# Altium schematic sheet Reset.SchDoc
size A4
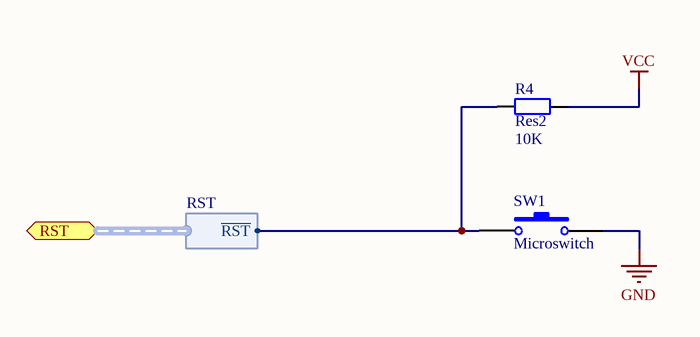
[diagram p0: Reset.SchDoc]

## Parts
R4  Res2  value 10K  [AXIAL-0.4]
SW1  Microswitch  [DIP Microswitch 6x6mm]

## Ports
RST (harness RST)

## Harnesses
RST: ~{RST}

## Nets
GND: SW1.2
VCC: R4.2
NetR4_1: R4.1 SW1.1 ; port RST.~{RST}

## Library data of the parts
R4 = Res2: Resistor; Published: 8-Jun-2000; LatestRevisionDate: 17-Jul-2002; LatestRevisionNote: Re-released for DXP Platform.; PackageReference: AXIAL-0.4; Publisher: Altium Limited